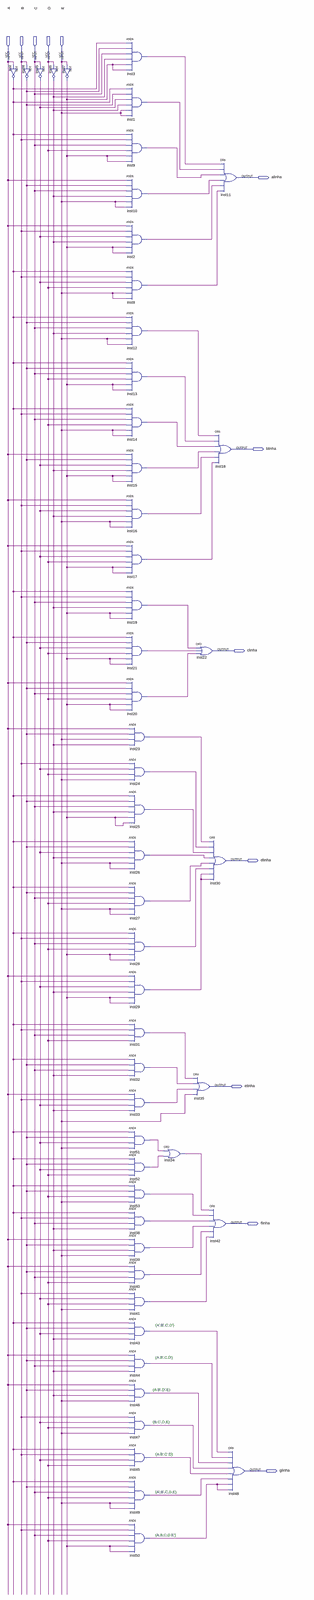
[diagram p0: schematic sheet, whole]
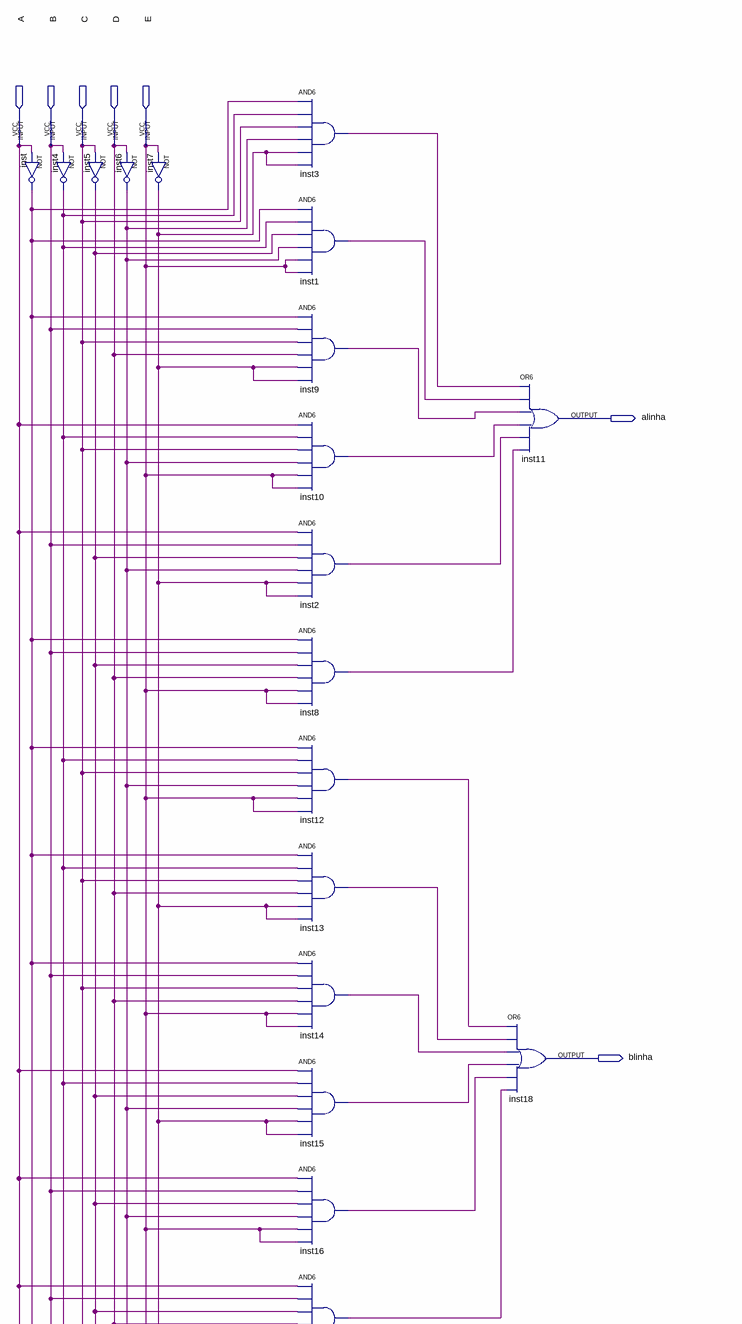
[diagram p1: schematic sheet, upper part]
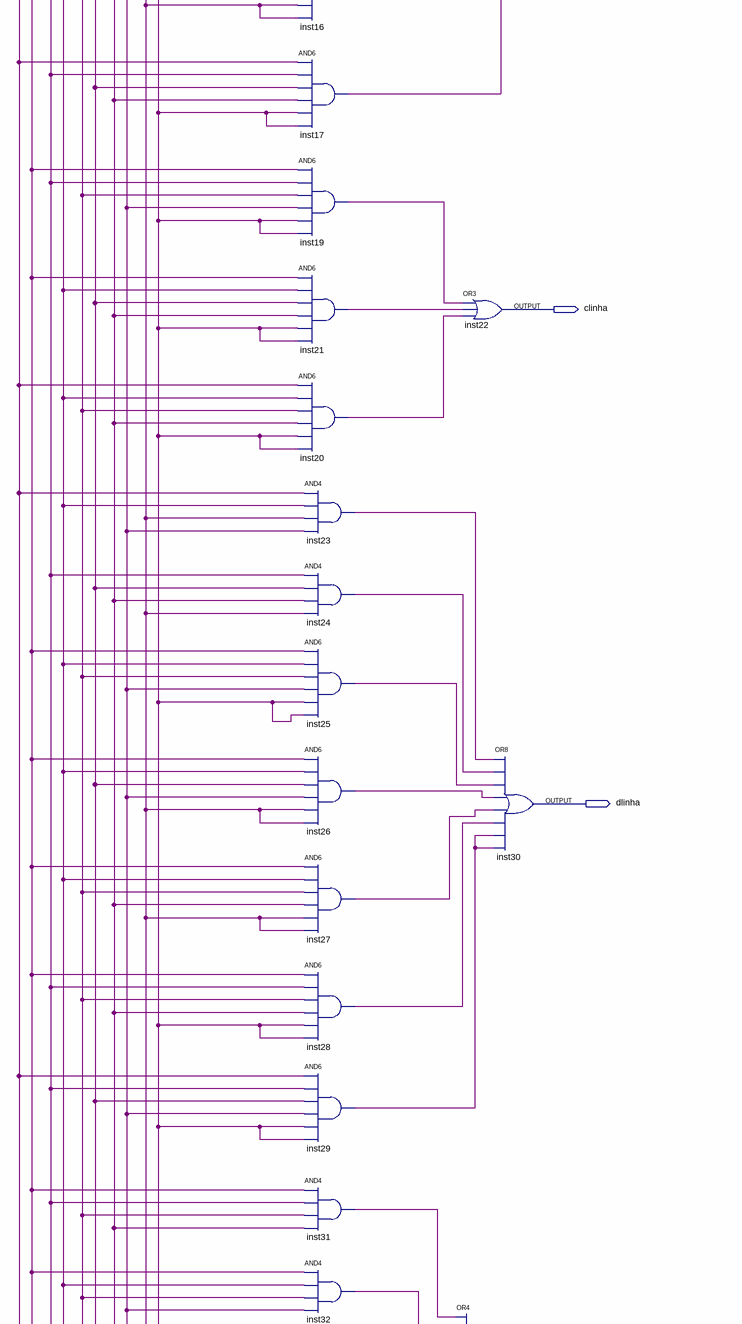
[diagram p2: schematic sheet, middle part]
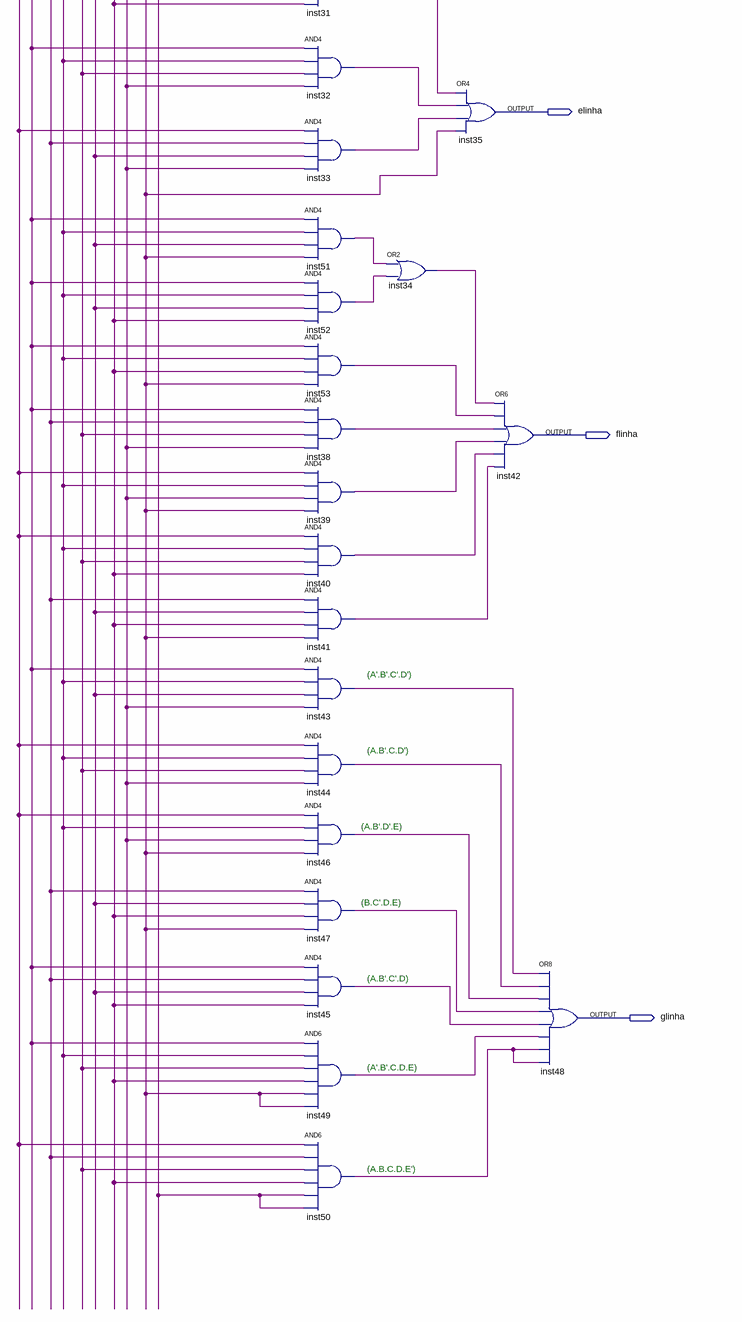
[diagram p3: schematic sheet, lower part]
// Quartus schematic DisplayUnidade.bdf as structural Verilog: 52 symbols, 12 pins
module DisplayUnidade (
  input  A,
  input  B,
  input  C,
  input  D,
  input  E,
  output alinha,
  output blinha,
  output clinha,
  output dlinha,
  output elinha,
  output flinha,
  output glinha
);

  wire inst1_out, inst2_out, inst3_out, inst4_out, inst5_out, inst6_out, inst7_out, inst8_out, inst9_out,
       inst10_out, inst12_out, inst13_out, inst14_out, inst15_out, inst16_out, inst17_out, inst19_out,
       inst20_out, inst21_out, inst23_out, inst24_out, inst25_out, inst26_out, inst27_out, inst28_out,
       inst29_out, inst31_out, inst32_out, inst33_out, inst34_out, inst38_out, inst39_out, inst40_out,
       inst41_out, inst43_out, inst44_out, inst45_out, inst46_out, inst47_out, inst49_out, inst50_out,
       inst51_out, inst52_out, inst53_out, inst_out;

  not inst (inst_out, A);
  not inst4 (inst4_out, B);
  not inst5 (inst5_out, C);
  not inst6 (inst6_out, D);
  not inst7 (inst7_out, E);
  and inst3 (inst3_out, inst_out, inst4_out, C, inst6_out, inst7_out, inst7_out);
  and inst1 (inst1_out, inst_out, inst4_out, inst5_out, inst6_out, E, E);
  and inst9 (inst9_out, inst_out, B, C, D, inst7_out, inst7_out);
  and inst10 (inst10_out, A, inst4_out, C, inst6_out, E, E);
  and inst2 (inst2_out, A, B, inst5_out, inst6_out, inst7_out, inst7_out);
  and inst8 (inst8_out, inst_out, B, inst5_out, D, E, E);
  and inst12 (inst12_out, inst_out, inst4_out, C, inst6_out, E, E);
  and inst13 (inst13_out, inst_out, inst4_out, C, D, inst7_out, inst7_out);
  and inst14 (inst14_out, inst_out, B, C, D, E, E);
  and inst15 (inst15_out, A, inst4_out, inst5_out, inst6_out, inst7_out, inst7_out);
  and inst16 (inst16_out, A, B, inst5_out, inst6_out, E, E);
  and inst17 (inst17_out, A, B, inst5_out, D, inst7_out, inst7_out);
  and inst19 (inst19_out, inst_out, B, C, inst6_out, inst7_out, inst7_out);
  and inst21 (inst21_out, inst_out, inst4_out, inst5_out, D, inst7_out, inst7_out);
  and inst20 (inst20_out, A, inst4_out, C, D, inst7_out, inst7_out);
  and inst23 (inst23_out, A, inst4_out, E, inst6_out);
  and inst24 (inst24_out, B, inst5_out, D, E);
  and inst25 (inst25_out, inst_out, inst4_out, C, inst6_out, inst7_out, inst7_out);
  and inst26 (inst26_out, inst_out, inst4_out, inst5_out, inst6_out, E, E);
  and inst27 (inst27_out, inst_out, inst4_out, C, D, E, E);
  and inst28 (inst28_out, inst_out, B, C, D, inst7_out, inst7_out);
  and inst29 (inst29_out, A, B, inst5_out, inst6_out, inst7_out, inst7_out);
  and inst31 (inst31_out, inst_out, B, C, D);
  and inst32 (inst32_out, inst_out, inst4_out, C, inst6_out);
  and inst33 (inst33_out, A, B, inst5_out, inst6_out);
  and inst51 (inst51_out, inst_out, inst4_out, inst5_out, E);
  and inst52 (inst52_out, inst_out, inst4_out, inst5_out, D);
  and inst53 (inst53_out, inst_out, inst4_out, D, E);
  and inst38 (inst38_out, inst_out, B, C, inst6_out);
  and inst39 (inst39_out, A, inst4_out, inst6_out, E);
  and inst40 (inst40_out, A, inst4_out, C, D);
  and inst41 (inst41_out, B, inst5_out, D, E);
  and inst43 (inst43_out, inst_out, inst4_out, inst5_out, inst6_out);
  and inst44 (inst44_out, A, inst4_out, C, inst6_out);
  and inst46 (inst46_out, A, inst4_out, inst6_out, E);
  and inst47 (inst47_out, B, inst5_out, D, E);
  and inst45 (inst45_out, inst_out, B, inst5_out, D);
  and inst49 (inst49_out, inst_out, inst4_out, C, D, E, E);
  and inst50 (inst50_out, A, B, C, D, inst7_out, inst7_out);
  or inst34 (inst34_out, inst51_out, inst52_out);
  or inst22 (clinha, inst19_out, inst21_out, inst20_out);
  or inst30 (dlinha, inst23_out, inst24_out, inst25_out, inst26_out, inst27_out, inst28_out, inst29_out, inst29_out);
  or inst35 (elinha, inst31_out, inst32_out, inst33_out, E);
  or inst42 (flinha, inst34_out, inst53_out, inst38_out, inst39_out, inst40_out, inst41_out);
  or inst11 (alinha, inst3_out, inst1_out, inst9_out, inst10_out, inst2_out, inst8_out);
  or inst18 (blinha, inst12_out, inst13_out, inst14_out, inst15_out, inst16_out, inst17_out);
  or inst48 (glinha, inst43_out, inst44_out, inst46_out, inst47_out, inst45_out, inst49_out, inst50_out, inst50_out);

  // Notes on the sheet:
  //   (A'.B'.C'.D')
  //   (A.B'.C.D')
  //   (A.B'.D'.E)
  //   (B.C'.D.E)
  //   (A.B'.C'.D)
  //   (A'.B'.C.D.E)
  //   (A.B.C.D.E')
endmodule
